# Altium schematic sheet Main.SchDoc
size B; SheetNumber: 1; SheetTotal: 3
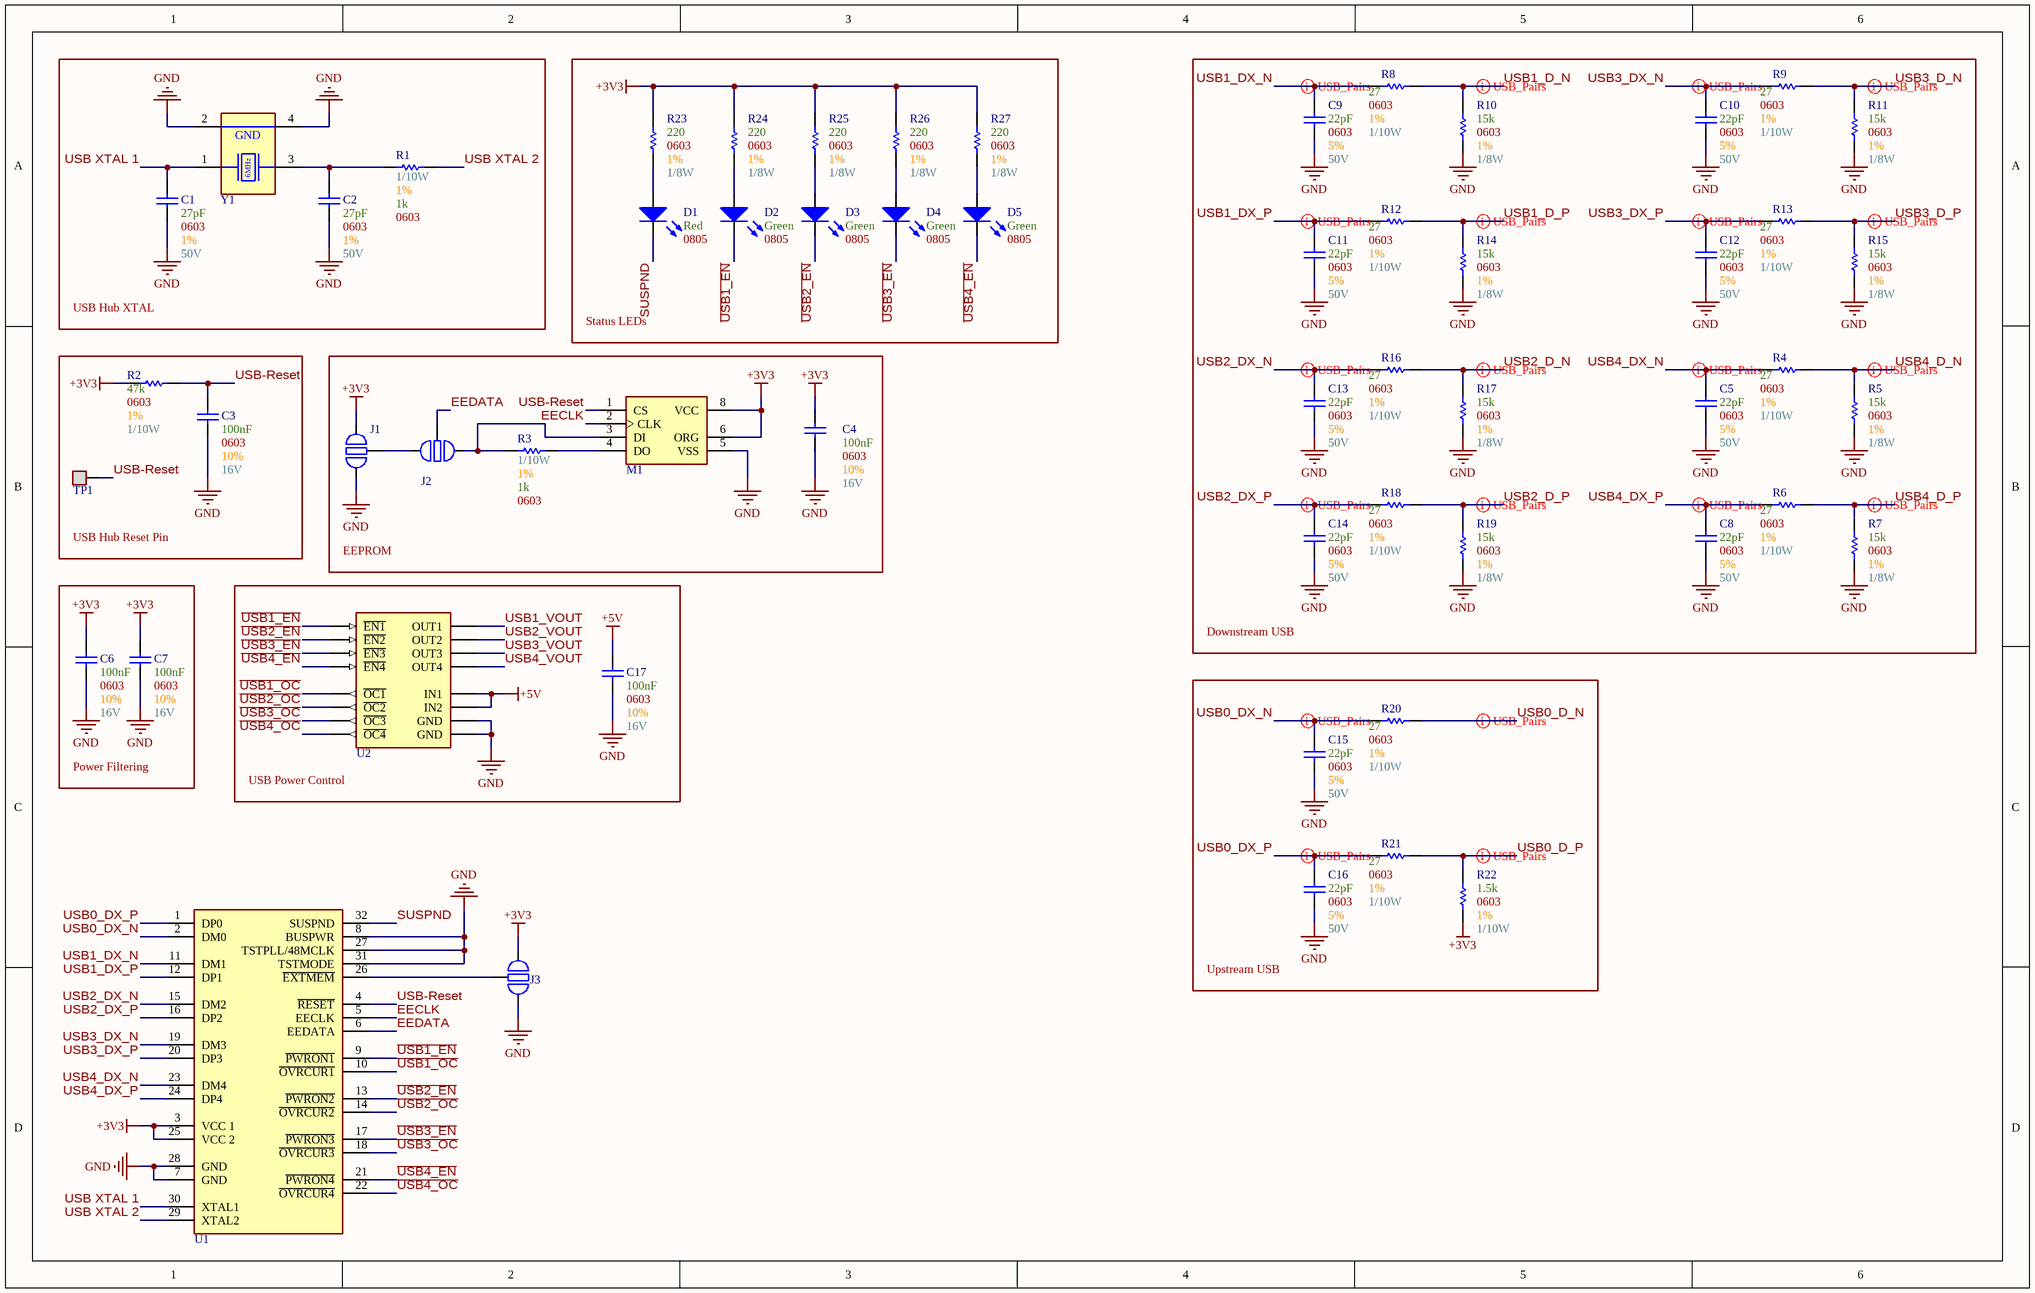
[diagram p0: Main.SchDoc]

## Parts
C1  Max Voltage: 50V  Size Package: 0603  Tolerance: 1%  Capacitance: 27pF  [[Cap] SMD 0603]  (hidden comment: [Cap] 0603 27pF 1% 50V)
C2  Max Voltage: 50V  Size Package: 0603  Tolerance: 1%  Capacitance: 27pF  [[Cap] SMD 0603]  (hidden comment: [Cap] 0603 27pF 1% 50V)
C3  Max Voltage: 16V  Size Package: 0603  Tolerance: 10%  Capacitance: 100nF  [[Cap] SMD 0603]  (hidden comment: [Cap] 0603 0.1uF 10% 16V)
C4  Max Voltage: 16V  Size Package: 0603  Tolerance: 10%  Capacitance: 100nF  [[Cap] SMD 0603]  (hidden comment: [Cap] 0603 0.1uF 10% 16V)
C5  Max Voltage: 50V  Size Package: 0603  Tolerance: 5%  Capacitance: 22pF  [[Cap] SMD 0603]  (hidden comment: [Cap] 0603 22pF 5% 50V)
C6  Max Voltage: 16V  Size Package: 0603  Tolerance: 10%  Capacitance: 100nF  [[Cap] SMD 0603]  (hidden comment: [Cap] 0603 0.1uF 10% 16V)
C7  Max Voltage: 16V  Size Package: 0603  Tolerance: 10%  Capacitance: 100nF  [[Cap] SMD 0603]  (hidden comment: [Cap] 0603 0.1uF 10% 16V)
C8  Max Voltage: 50V  Size Package: 0603  Tolerance: 5%  Capacitance: 22pF  [[Cap] SMD 0603]  (hidden comment: [Cap] 0603 22pF 5% 50V)
C9  Max Voltage: 50V  Size Package: 0603  Tolerance: 5%  Capacitance: 22pF  [[Cap] SMD 0603]  (hidden comment: [Cap] 0603 22pF 5% 50V)
C10  Max Voltage: 50V  Size Package: 0603  Tolerance: 5%  Capacitance: 22pF  [[Cap] SMD 0603]  (hidden comment: [Cap] 0603 22pF 5% 50V)
C11  Max Voltage: 50V  Size Package: 0603  Tolerance: 5%  Capacitance: 22pF  [[Cap] SMD 0603]  (hidden comment: [Cap] 0603 22pF 5% 50V)
C12  Max Voltage: 50V  Size Package: 0603  Tolerance: 5%  Capacitance: 22pF  [[Cap] SMD 0603]  (hidden comment: [Cap] 0603 22pF 5% 50V)
C13  Max Voltage: 50V  Size Package: 0603  Tolerance: 5%  Capacitance: 22pF  [[Cap] SMD 0603]  (hidden comment: [Cap] 0603 22pF 5% 50V)
C14  Max Voltage: 50V  Size Package: 0603  Tolerance: 5%  Capacitance: 22pF  [[Cap] SMD 0603]  (hidden comment: [Cap] 0603 22pF 5% 50V)
C15  Max Voltage: 50V  Size Package: 0603  Tolerance: 5%  Capacitance: 22pF  [[Cap] SMD 0603]  (hidden comment: [Cap] 0603 22pF 5% 50V)
C16  Max Voltage: 50V  Size Package: 0603  Tolerance: 5%  Capacitance: 22pF  [[Cap] SMD 0603]  (hidden comment: [Cap] 0603 22pF 5% 50V)
C17  Max Voltage: 16V  Size Package: 0603  Tolerance: 10%  Capacitance: 100nF  [[Cap] SMD 0603]  (hidden comment: [Cap] 0603 0.1uF 10% 16V)
D1  Color: Red  Size Package: 0805  [[LED] SMD 0805]  (hidden comment: [LED] SMD 0805 Red)
D2  Color: Green  Size Package: 0805  [[LED] SMD 0805]  (hidden comment: [LED] SMD 0805 Green)
D3  Color: Green  Size Package: 0805  [[LED] SMD 0805]  (hidden comment: [LED] SMD 0805 Green)
D4  Color: Green  Size Package: 0805  [[LED] SMD 0805]  (hidden comment: [LED] SMD 0805 Green)
D5  Color: Green  Size Package: 0805  [[LED] SMD 0805]  (hidden comment: [LED] SMD 0805 Green)
J1  [Jumper] Thru-Hole 3pin  [[Jumper] Thru-Hole 3pin]  (value not drawn)  (no BOM)
J2  [Jumper] Thru-Hole 3pin  [[Jumper] Thru-Hole 3pin]  (value not drawn)  (no BOM)
J3  [Jumper] Thru-Hole 3pin  [[Jumper] Thru-Hole 3pin]  (value not drawn)  (no BOM)
M1  [Flash] 32x16b  [[Flash] 32x16b]  (value not drawn)
R1  Wattage: 1/10W  Tolerance: 1%  Resistance: 1k  Size Package: 0603  [[Res] SMD 0603]  (hidden comment: [1k] SMD 0603 1% 1/10W)
R2  Wattage: 1/10W  Tolerance: 1%  Resistance: 47k  Size Package: 0603  [[Res] SMD 0603]  (hidden comment: [47k] SMD 0603 1% 1/10W)
R3  Wattage: 1/10W  Tolerance: 1%  Resistance: 1k  Size Package: 0603  [[Res] SMD 0603]  (hidden comment: [1k] SMD 0603 1% 1/10W)
R4  Wattage: 1/10W  Tolerance: 1%  Resistance: 27  Size Package: 0603  [[Res] SMD 0603]  (hidden comment: [27] SMD 0603 1% 1/10W)
R5  Wattage: 1/8W  Tolerance: 1%  Resistance: 15k  Size Package: 0603  [[Res] SMD 0603]  (hidden comment: [15k] SMD 0603 1% 1/8W)
R6  Wattage: 1/10W  Tolerance: 1%  Resistance: 27  Size Package: 0603  [[Res] SMD 0603]  (hidden comment: [27] SMD 0603 1% 1/10W)
R7  Wattage: 1/8W  Tolerance: 1%  Resistance: 15k  Size Package: 0603  [[Res] SMD 0603]  (hidden comment: [15k] SMD 0603 1% 1/8W)
R8  Wattage: 1/10W  Tolerance: 1%  Resistance: 27  Size Package: 0603  [[Res] SMD 0603]  (hidden comment: [27] SMD 0603 1% 1/10W)
R9  Wattage: 1/10W  Tolerance: 1%  Resistance: 27  Size Package: 0603  [[Res] SMD 0603]  (hidden comment: [27] SMD 0603 1% 1/10W)
R10  Wattage: 1/8W  Tolerance: 1%  Resistance: 15k  Size Package: 0603  [[Res] SMD 0603]  (hidden comment: [15k] SMD 0603 1% 1/8W)
R11  Wattage: 1/8W  Tolerance: 1%  Resistance: 15k  Size Package: 0603  [[Res] SMD 0603]  (hidden comment: [15k] SMD 0603 1% 1/8W)
R12  Wattage: 1/10W  Tolerance: 1%  Resistance: 27  Size Package: 0603  [[Res] SMD 0603]  (hidden comment: [27] SMD 0603 1% 1/10W)
R13  Wattage: 1/10W  Tolerance: 1%  Resistance: 27  Size Package: 0603  [[Res] SMD 0603]  (hidden comment: [27] SMD 0603 1% 1/10W)
R14  Wattage: 1/8W  Tolerance: 1%  Resistance: 15k  Size Package: 0603  [[Res] SMD 0603]  (hidden comment: [15k] SMD 0603 1% 1/8W)
R15  Wattage: 1/8W  Tolerance: 1%  Resistance: 15k  Size Package: 0603  [[Res] SMD 0603]  (hidden comment: [15k] SMD 0603 1% 1/8W)
R16  Wattage: 1/10W  Tolerance: 1%  Resistance: 27  Size Package: 0603  [[Res] SMD 0603]  (hidden comment: [27] SMD 0603 1% 1/10W)
R17  Wattage: 1/8W  Tolerance: 1%  Resistance: 15k  Size Package: 0603  [[Res] SMD 0603]  (hidden comment: [15k] SMD 0603 1% 1/8W)
R18  Wattage: 1/10W  Tolerance: 1%  Resistance: 27  Size Package: 0603  [[Res] SMD 0603]  (hidden comment: [27] SMD 0603 1% 1/10W)
R19  Wattage: 1/8W  Tolerance: 1%  Resistance: 15k  Size Package: 0603  [[Res] SMD 0603]  (hidden comment: [15k] SMD 0603 1% 1/8W)
R20  Wattage: 1/10W  Tolerance: 1%  Resistance: 27  Size Package: 0603  [[Res] SMD 0603]  (hidden comment: [27] SMD 0603 1% 1/10W)
R21  Wattage: 1/10W  Tolerance: 1%  Resistance: 27  Size Package: 0603  [[Res] SMD 0603]  (hidden comment: [27] SMD 0603 1% 1/10W)
R22  Wattage: 1/10W  Tolerance: 1%  Resistance: 1.5k  Size Package: 0603  [[Res] SMD 0603]  (hidden comment: [1.5k] SMD 0603 1% 1/10W)
R23  Wattage: 1/8W  Tolerance: 1%  Resistance: 220  Size Package: 0603  [[Res] SMD 0603]  (hidden comment: [220] SMD 0603 1% 1/10W)
R24  Wattage: 1/8W  Tolerance: 1%  Resistance: 220  Size Package: 0603  [[Res] SMD 0603]  (hidden comment: [220] SMD 0603 1% 1/10W)
R25  Wattage: 1/8W  Tolerance: 1%  Resistance: 220  Size Package: 0603  [[Res] SMD 0603]  (hidden comment: [220] SMD 0603 1% 1/10W)
R26  Wattage: 1/8W  Tolerance: 1%  Resistance: 220  Size Package: 0603  [[Res] SMD 0603]  (hidden comment: [220] SMD 0603 1% 1/10W)
R27  Wattage: 1/8W  Tolerance: 1%  Resistance: 220  Size Package: 0603  [[Res] SMD 0603]  (hidden comment: [220] SMD 0603 1% 1/10W)
TP1  [THM] Thru-Hole  [[THM] White]  (value not drawn)
U1  4port  [[USB Hub] USB2.0 4port]  (value not drawn)
U2  [USB Power] 500mA 4port  [[IC] USB Hub Power Distribution]  (value not drawn)
Y1  [Crystal] SMD 6MHz  [[Crystal] SMD 6MHz]  (value not drawn)

## Blocks framed on the sheet
USB Hub XTAL: C1 C2 R1 Y1
Status LEDs: D1-D5 R23-R27
Downstream USB: C5 C8-C14 R4-R19
USB Hub Reset Pin: C3 R2 TP1
EEPROM: C4 J1 J2 M1 R3
Power Filtering: C6 C7
USB Power Control: C17 U2
Upstream USB: C15 C16 R20-R22

## Nets
+3V3: C4.2 C6.2 C7.2 J1.3 J3.3 M1.6(ORG) M1.8(VCC) R2.1 R22.1 R23.2 R24.2 R25.2 R26.2 R27.2 U1.3(VCC_1) U1.25(VCC_2)
+5V: C17.2 U2.2(IN1) U2.6(IN2)
GND: C1.1 C2.1 C3.1 C4.1 C5.1 C6.1 C7.1 C8.1 C9.1 C10.1 C11.1 C12.1 C13.1 C14.1 C15.1 C16.1 C17.1 J1.1 J3.1 M1.5(VSS) R5.1 R7.1 R10.1 R11.1 R14.1 R15.1 R17.1 R19.1 U1.7(GND) U1.8(BUSPWR) U1.27(TSTPLL/48MCLK) U1.28(GND) U1.31(TSTMODE) U2.1(GND) U2.5(GND) Y1.2(GND) Y1.4(GND)
~{USB1_EN}: D2.2(Cathode) U1.9(~{PWRON1}) U2.3(~{EN1})
~{USB1_OC}: U1.10(~{OVRCUR1}) U2.16(~{OC1})
~{USB2_EN}: D3.2(Cathode) U1.13(~{PWRON2}) U2.4(~{EN2})
~{USB2_OC}: U1.14(~{OVRCUR2}) U2.13(~{OC2})
~{USB3_EN}: D4.2(Cathode) U1.17(~{PWRON3}) U2.7(~{EN3})
~{USB3_OC}: U1.18(~{OVRCUR3}) U2.12(~{OC3})
~{USB4_EN}: D5.2(Cathode) U1.21(~{PWRON4}) U2.8(~{EN4})
~{USB4_OC}: U1.22(~{OVRCUR4}) U2.9(~{OC4})
EECLK: M1.2(CLK) U1.5(EECLK)
EEDATA: J2.2(Common) U1.6(EEDATA)
SUSPND: D1.2(Cathode) U1.32(SUSPND)
USB0_D_N: R20.2
USB0_D_P: R21.2 R22.2
USB0_DX_N: C15.2 R20.1 U1.2(DM0)
USB0_DX_P: C16.2 R21.1 U1.1(DP0)
USB1_D_N: R8.2 R10.2
USB1_D_P: R12.2 R14.2
USB1_DX_N: C9.2 R8.1 U1.11(DM1)
USB1_DX_P: C11.2 R12.1 U1.12(DP1)
USB1_VOUT: U2.15(OUT1)
USB2_D_N: R16.2 R17.2
USB2_D_P: R18.2 R19.2
USB2_DX_N: C13.2 R16.1 U1.15(DM2)
USB2_DX_P: C14.2 R18.1 U1.16(DP2)
USB2_VOUT: U2.14(OUT2)
USB3_D_N: R9.2 R11.2
USB3_D_P: R13.2 R15.2
USB3_DX_N: C10.2 R9.1 U1.19(DM3)
USB3_DX_P: C12.2 R13.1 U1.20(DP3)
USB3_VOUT: U2.11(OUT3)
USB4_D_N: R4.2 R5.2
USB4_D_P: R6.2 R7.2
USB4_DX_N: C5.2 R4.1 U1.23(DM4)
USB4_DX_P: C8.2 R6.1 U1.24(DP4)
USB4_VOUT: U2.10(OUT4)
USB XTAL 1: C1.2 U1.30(XTAL1) Y1.1(XTAL1)
USB XTAL 2: R1.2 U1.29(XTAL2)
USB-Reset: C3.2 M1.1(CS) R2.2 TP1.1 U1.4(~{RESET})
NetC2_2: C2.2 R1.1 Y1.3(XTAL2)
NetD1_1: D1.1(Anode) R23.1
NetD2_1: D2.1(Anode) R24.1
NetD3_1: D3.1(Anode) R25.1
NetD4_1: D4.1(Anode) R26.1
NetD5_1: D5.1(Anode) R27.1
NetJ1_2: J1.2(Common) J2.3
NetJ2_1: J2.1 M1.3(DI) R3.2
NetJ3_2: J3.2(Common) U1.26(~{EXTMEM})
NetM1_4: M1.4(DO) R3.1

## Layout directives
differential pair: USB0_D_N, USB0_D_P, USB0_DX_N, USB0_DX_P, USB1_D_N, USB1_D_P, USB1_DX_N, USB1_DX_P, USB2_D_N, USB2_D_P, USB2_DX_N, USB2_DX_P, USB3_D_N, USB3_D_P, USB3_DX_N, USB3_DX_P, USB4_D_N, USB4_D_P, USB4_DX_N, USB4_DX_P

## Notes on the sheet
- (in symbol [Crystal] SMD 6MHz) 6MHz

## Library data of the parts
C1 C2 = [Cap] 0603 27pF 1% 50V: 0603N270F500CT; Supplier 1: DigiKey; Supplier Part Number 1: 1292-1510-1-ND
C3 C4 C6 C7 C17 = [Cap] 0603 0.1uF 10% 16V: CC0603KRX7R7BB104; Supplier 1: DigiKey; Supplier Part Number 1: 311-1088-6-ND
C5 C8-C16 = [Cap] 0603 22pF 5% 50V: CC0603JRNPO9BN240; Supplier 1: DigiKey; Supplier Part Number 1: 311-1062-1-ND
D1 = [LED] SMD 0805 Red: LS R976-NR-1-0-20-R18; Supplier 1: DigiKey; Supplier Part Number 1: 475-LSR976-NR-1CT-ND
D2-D5 = [LED] SMD 0805 Green: LG R971-KN-1-0-20-R18; Supplier 1: DigiKey; Supplier Part Number 1: 475-LGR971-KN-1CT-ND
M1 = [Flash] 32x16b: M93C46-WMN6TP; Supplier 1: DigiKey; Supplier Part Number 1: 497-5090-1-ND
R1 R3 = [1k] SMD 0603 1% 1/10W: RMCF0603FT1K00; Supplier 1: DigiKey; Supplier Part Number 1: RMCF0603FT1K00DKR-ND
R2 = [47k] SMD 0603 1% 1/10W: RC0603FR-0747KL; Supplier 1: DigiKey; Supplier Part Number 1: 311-47.0KHRDKR-ND
R4 R6 R8 R9 R12 R13 R16 R18 R20 R21 = [27] SMD 0603 1% 1/10W: MCT06030C2709FP500; Supplier 1: DigiKey; Supplier Part Number 1: 749-1631-1-ND
R5 R7 R10 R11 R14 R15 R17 R19 = [15k] SMD 0603 1% 1/8W: CRCW060315K0FKEA; Supplier 1: DigiKey; Supplier Part Number 1: 541-15.0KHCT-ND
R22 = [1.5k] SMD 0603 1% 1/10W: CR0603-FX-1501ELF; Supplier 1: DigiKey; Supplier Part Number 1: 118-CR0603-FX-1501ELFCT-ND
R23-R27 = [220] SMD 0603 1% 1/10W: CRGCQ0805F220R; Supplier 1: DigiKey; Supplier Part Number 1: A129741CT-ND
TP1 = [THM] Thru-Hole: 5012; Supplier 1: DigiKey; Supplier Part Number 1: 36-5012-ND
U1 = [USB Hub] USB 2.0 4port: TUSB2046BVFR; Supplier 1: DigiKey; Supplier Part Number 1: 296-27131-1-ND
U2 = [USB Power] 500mA 4port: TPS2044BDR; Supplier 1: DigiKey; Supplier Part Number 1: 296-26909-6-ND
Y1 = [Crystal] SMD 6MHz: ECS-060-18-20BM-JEN-TR; Supplier 1: DigiKey; Supplier Part Number 1: XC2349DKR-ND